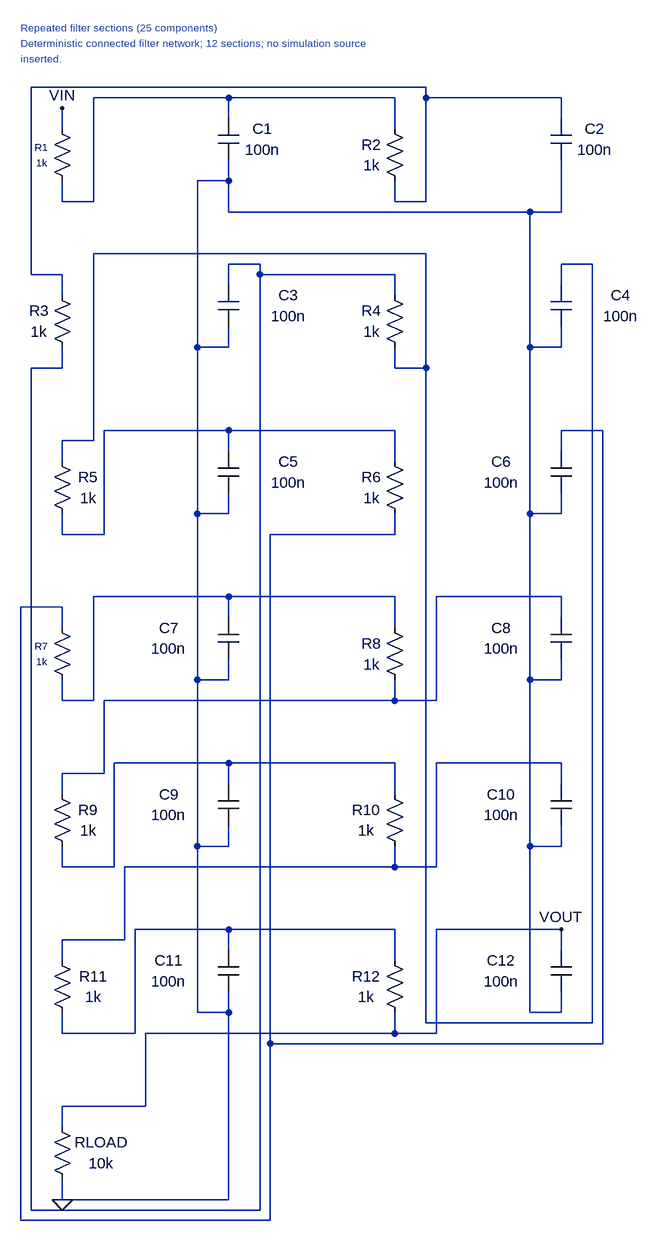
[diagram p0: schematic circuit.asc]
circuit.asc, the LTspice schematic file:
Version 4
SHEET 1 1024 1920
SYMBOL cap 320 128 R0
WINDOW 0 68 16 Center 2
WINDOW 3 68 48 Center 2
SYMATTR InstName C1
SYMATTR Value 100n
SYMBOL cap 832 128 R0
WINDOW 0 68 16 Center 2
WINDOW 3 68 48 Center 2
SYMATTR InstName C2
SYMATTR Value 100n
SYMBOL cap 320 384 R0
WINDOW 0 108 16 Center 2
WINDOW 3 108 48 Center 2
SYMATTR InstName C3
SYMATTR Value 100n
SYMBOL cap 832 384 R0
WINDOW 0 108 16 Center 2
WINDOW 3 108 48 Center 2
SYMATTR InstName C4
SYMATTR Value 100n
SYMBOL cap 320 640 R0
WINDOW 0 108 16 Center 2
WINDOW 3 108 48 Center 2
SYMATTR InstName C5
SYMATTR Value 100n
SYMBOL cap 832 640 R0
WINDOW 0 -76 16 Center 2
WINDOW 3 -76 48 Center 2
SYMATTR InstName C6
SYMATTR Value 100n
SYMBOL cap 320 896 R0
WINDOW 0 -76 16 Center 2
WINDOW 3 -76 48 Center 2
SYMATTR InstName C7
SYMATTR Value 100n
SYMBOL cap 832 896 R0
WINDOW 0 -76 16 Center 2
WINDOW 3 -76 48 Center 2
SYMATTR InstName C8
SYMATTR Value 100n
SYMBOL cap 320 1152 R0
WINDOW 0 -76 16 Center 2
WINDOW 3 -76 48 Center 2
SYMATTR InstName C9
SYMATTR Value 100n
SYMBOL cap 832 1152 R0
WINDOW 0 -76 16 Center 2
WINDOW 3 -76 48 Center 2
SYMATTR InstName C10
SYMATTR Value 100n
SYMBOL cap 320 1408 R0
WINDOW 0 -76 16 Center 2
WINDOW 3 -76 48 Center 2
SYMATTR InstName C11
SYMATTR Value 100n
SYMBOL cap 832 1408 R0
WINDOW 0 -76 16 Center 2
WINDOW 3 -76 48 Center 2
SYMATTR InstName C12
SYMATTR Value 100n
SYMBOL res 64 128 R0
WINDOW 0 -16 44 Center 1
WINDOW 3 -16 68 Center 1
SYMATTR InstName R1
SYMATTR Value 1k
SYMBOL res 576 128 R0
WINDOW 0 -20 40 Center 2
WINDOW 3 -20 72 Center 2
SYMATTR InstName R2
SYMATTR Value 1k
SYMBOL res 64 384 R0
WINDOW 0 -20 40 Center 2
WINDOW 3 -20 72 Center 2
SYMATTR InstName R3
SYMATTR Value 1k
SYMBOL res 576 384 R0
WINDOW 0 -20 40 Center 2
WINDOW 3 -20 72 Center 2
SYMATTR InstName R4
SYMATTR Value 1k
SYMBOL res 64 640 R0
WINDOW 0 56 40 Center 2
WINDOW 3 56 72 Center 2
SYMATTR InstName R5
SYMATTR Value 1k
SYMBOL res 576 640 R0
WINDOW 0 -20 40 Center 2
WINDOW 3 -20 72 Center 2
SYMATTR InstName R6
SYMATTR Value 1k
SYMBOL res 64 896 R0
WINDOW 0 -16 44 Center 1
WINDOW 3 -16 68 Center 1
SYMATTR InstName R7
SYMATTR Value 1k
SYMBOL res 576 896 R0
WINDOW 0 -20 40 Center 2
WINDOW 3 -20 72 Center 2
SYMATTR InstName R8
SYMATTR Value 1k
SYMBOL res 64 1152 R0
WINDOW 0 56 40 Center 2
WINDOW 3 56 72 Center 2
SYMATTR InstName R9
SYMATTR Value 1k
SYMBOL res 576 1152 R0
WINDOW 0 -28 40 Center 2
WINDOW 3 -28 72 Center 2
SYMATTR InstName R10
SYMATTR Value 1k
SYMBOL res 64 1408 R0
WINDOW 0 64 40 Center 2
WINDOW 3 64 72 Center 2
SYMATTR InstName R11
SYMATTR Value 1k
SYMBOL res 576 1408 R0
WINDOW 0 -28 40 Center 2
WINDOW 3 -28 72 Center 2
SYMATTR InstName R12
SYMATTR Value 1k
SYMBOL res 64 1664 R0
WINDOW 0 76 40 Center 2
WINDOW 3 76 72 Center 2
SYMATTR InstName RLOAD
SYMATTR Value 10k
WIRE 16 880 16 1824
WIRE 16 880 80 880
WIRE 16 1824 400 1824
WIRE 32 80 32 368
WIRE 32 80 640 80
WIRE 32 368 80 368
WIRE 32 512 32 1808
WIRE 32 512 80 512
WIRE 32 1808 384 1808
WIRE 80 112 80 144
WIRE 80 224 80 256
WIRE 80 256 128 256
WIRE 80 368 80 400
WIRE 80 480 80 512
WIRE 80 624 80 656
WIRE 80 624 128 624
WIRE 80 736 80 768
WIRE 80 768 144 768
WIRE 80 880 80 912
WIRE 80 992 80 1024
WIRE 80 1024 128 1024
WIRE 80 1136 80 1168
WIRE 80 1136 144 1136
WIRE 80 1248 80 1280
WIRE 80 1280 160 1280
WIRE 80 1392 80 1424
WIRE 80 1392 176 1392
WIRE 80 1504 80 1536
WIRE 80 1536 192 1536
WIRE 80 1648 80 1680
WIRE 80 1648 208 1648
WIRE 80 1760 80 1792
WIRE 80 1792 336 1792
WIRE 128 96 128 256
WIRE 128 96 336 96
WIRE 128 336 128 624
WIRE 128 336 640 336
WIRE 128 864 128 1024
WIRE 128 864 336 864
WIRE 144 608 144 768
WIRE 144 608 336 608
WIRE 144 1024 144 1136
WIRE 144 1024 592 1024
WIRE 160 1120 160 1280
WIRE 160 1120 336 1120
WIRE 176 1280 176 1392
WIRE 176 1280 592 1280
WIRE 192 1376 192 1536
WIRE 192 1376 336 1376
WIRE 208 1536 208 1648
WIRE 208 1536 592 1536
WIRE 288 224 288 480
WIRE 288 224 336 224
WIRE 288 480 288 736
WIRE 288 480 336 480
WIRE 288 736 288 992
WIRE 288 736 336 736
WIRE 288 992 288 1248
WIRE 288 992 336 992
WIRE 288 1248 288 1504
WIRE 288 1248 336 1248
WIRE 288 1504 336 1504
WIRE 336 96 336 128
WIRE 336 96 592 96
WIRE 336 192 336 224
WIRE 336 224 336 272
WIRE 336 272 800 272
WIRE 336 352 336 384
WIRE 336 352 384 352
WIRE 336 448 336 480
WIRE 336 608 336 640
WIRE 336 608 592 608
WIRE 336 704 336 736
WIRE 336 864 336 896
WIRE 336 864 592 864
WIRE 336 960 336 992
WIRE 336 1120 336 1152
WIRE 336 1120 592 1120
WIRE 336 1216 336 1248
WIRE 336 1376 336 1408
WIRE 336 1376 592 1376
WIRE 336 1472 336 1504
WIRE 336 1504 336 1792
WIRE 384 352 384 368
WIRE 384 368 384 1808
WIRE 384 368 592 368
WIRE 400 768 400 1552
WIRE 400 768 592 768
WIRE 400 1552 400 1824
WIRE 400 1552 912 1552
WIRE 592 96 592 144
WIRE 592 224 592 256
WIRE 592 256 640 256
WIRE 592 368 592 400
WIRE 592 480 592 512
WIRE 592 512 640 512
WIRE 592 608 592 656
WIRE 592 736 592 768
WIRE 592 864 592 912
WIRE 592 992 592 1024
WIRE 592 1024 656 1024
WIRE 592 1120 592 1168
WIRE 592 1248 592 1280
WIRE 592 1280 656 1280
WIRE 592 1376 592 1424
WIRE 592 1504 592 1536
WIRE 592 1536 656 1536
WIRE 640 80 640 96
WIRE 640 96 640 256
WIRE 640 96 848 96
WIRE 640 336 640 512
WIRE 640 512 640 1520
WIRE 640 1520 896 1520
WIRE 656 864 656 1024
WIRE 656 864 848 864
WIRE 656 1120 656 1280
WIRE 656 1120 848 1120
WIRE 656 1376 656 1536
WIRE 656 1376 848 1376
WIRE 800 272 800 480
WIRE 800 272 848 272
WIRE 800 480 800 736
WIRE 800 480 848 480
WIRE 800 736 800 992
WIRE 800 736 848 736
WIRE 800 992 800 1248
WIRE 800 992 848 992
WIRE 800 1248 800 1504
WIRE 800 1248 848 1248
WIRE 800 1504 848 1504
WIRE 848 96 848 128
WIRE 848 192 848 272
WIRE 848 352 848 384
WIRE 848 352 896 352
WIRE 848 448 848 480
WIRE 848 608 848 640
WIRE 848 608 912 608
WIRE 848 704 848 736
WIRE 848 864 848 896
WIRE 848 960 848 992
WIRE 848 1120 848 1152
WIRE 848 1216 848 1248
WIRE 848 1376 848 1408
WIRE 848 1472 848 1504
WIRE 896 352 896 1520
WIRE 912 608 912 1552
FLAG 80 1792 0
FLAG 80 112 VIN
FLAG 848 1376 VOUT
TEXT 16 -12 Left 1 ;Repeated filter sections (25 components)
TEXT 16 12 Left 1 ;Deterministic connected filter network; 12 sections; no simulation source
TEXT 16 36 Left 1 ;inserted.

The netlist it stands for:
* circuit.asc
C1 N004 0 100n
C2 N002 0 100n
C3 N003 0 100n
C4 N005 0 100n
C5 N006 0 100n
C6 N001 0 100n
C7 N007 0 100n
C8 N008 0 100n
C9 N009 0 100n
C10 N010 0 100n
C11 N011 0 100n
C12 VOUT 0 100n
R1 VIN N004 1k
R2 N004 N002 1k
R3 N002 N003 1k
R4 N003 N005 1k
R5 N005 N006 1k
R6 N006 N001 1k
R7 N001 N007 1k
R8 N007 N008 1k
R9 N008 N009 1k
R10 N009 N010 1k
R11 N010 N011 1k
R12 N011 VOUT 1k
RLOAD VOUT 0 10k
* Repeated filter sections (25 components)
* Deterministic connected filter network; 12 sections; no simulation source
* inserted.
.backanno
.end